# EAGLE schematic 3Sens+lowPass (EAGLE 6.6.0)
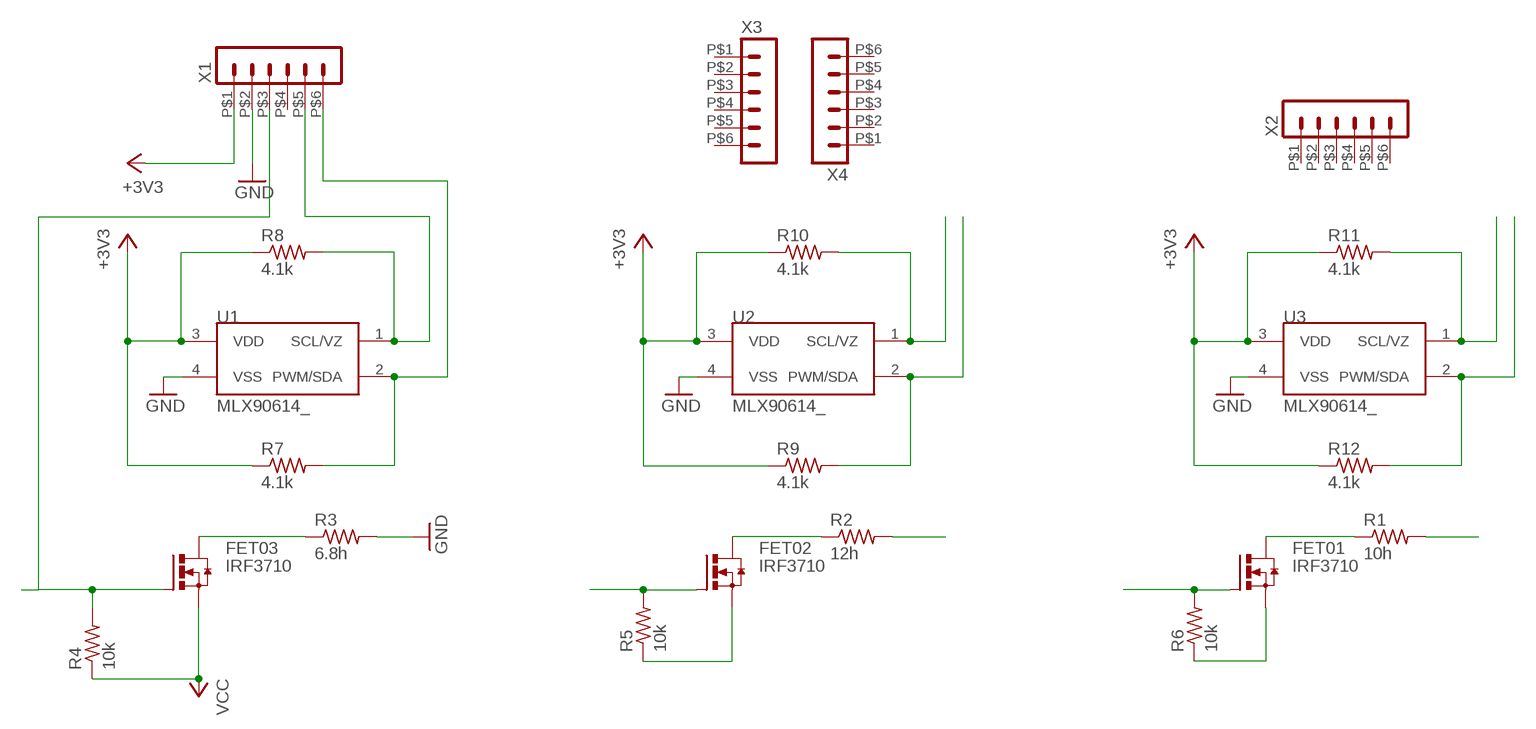
[diagram p0: schematic, sheet 1]

## Parts
FET01  IRF3710  IRF3704  [TO220AH]
FET02  IRF3710  IRF3704  [TO220AH]
FET03  IRF3710  IRF3704  [TO220AH]
R1  10h  R-US_0204/2V  [0204V]
R2  12h  R-US_0204/2V  [0204V]
R3  6.8h  R-US_0204/2V  [0204V]
R4  10k  R-US_0204/2V  [0204V]
R5  10k  R-US_0204/2V  [0204V]
R6  10k  R-US_0204/2V  [0204V]
R7  4.1k  R-US_0204/2V  [0204V]
R8  4.1k  R-US_0204/2V  [0204V]
R9  4.1k  R-US_0204/2V  [0204V]
R10  4.1k  R-US_0204/2V  [0204V]
R11  4.1k  R-US_0204/2V  [0204V]
R12  4.1k  R-US_0204/2V  [0204V]
U1  MLX90614_  [TO-39]
U2  MLX90614_  [TO-39]
U3  MLX90614_  [TO-39]
X1  HEADER_POS6_43045-0600  [43045-0600]
X2  HEADER_POS6_43045-0600  [43045-0600]
X3  HEADER_POS6_43650-0600  [43650-0600]
X4  HEADER_POS6_43650-0600  [43650-0600]

## Nets
+3V3: R7.1 R8.1 R9.1 R10.1 R11.1 R12.1 U1.3(VDD) U2.3(VDD) U3.3(VDD) X1.P$1
GND: R3.2 U1.4(VSS) U2.4(VSS) U3.4(VSS) X1.P$2
N$1: R8.2 U1.1(SCL/VZ) X1.P$5
N$3: FET02.B(G) R5.2
N$4: FET02.E(S) R5.1
N$5: FET01.B(G) R6.2
N$6: FET01.E(S) R6.1
N$8: R7.2 U1.2(PWM/SDA) X1.P$6
N$9: FET03.B(G) R4.2 X1.P$3
N$10: R2.2
N$11: R1.2
N$12: R10.2 U2.1(SCL/VZ)
N$13: R9.2 U2.2(PWM/SDA)
N$14: FET03.C(D) R3.1
N$15: R11.2 U3.1(SCL/VZ)
N$16: R12.2 U3.2(PWM/SDA)
N$17: FET02.C(D) R2.1
N$18: FET01.C(D) R1.1
VCC: FET03.E(S) R4.1
Unconnected: X1.P$4 X2.P$1 X2.P$2 X2.P$3 X2.P$4 X2.P$5 X2.P$6 X3.P$1 X3.P$2 X3.P$3 X3.P$4 X3.P$5 X3.P$6 X4.P$1 X4.P$2 X4.P$3 X4.P$4 X4.P$5 X4.P$6

## Library data of the parts
FET01-FET03 = transistor-power:IRF3704: SMPS MOSFET HEXFET® Power MOSFET Source: http://www.irf.com/product-info/datasheets/data/irf3704.pdf
R1-R12 = resistor:R-US_: RESISTOR, American symbol
U1-U3 = SparkFun-Sensors:MLX90614: Non-contact PIR I2C interface temperature sensor
X1-X4 = con-molex-micro-fit-3_0:HEADER_POS6_?: Molex - Micro-Fit 3.0 Series connector, 3.00mm (0.118") pitch header, 6 positions.